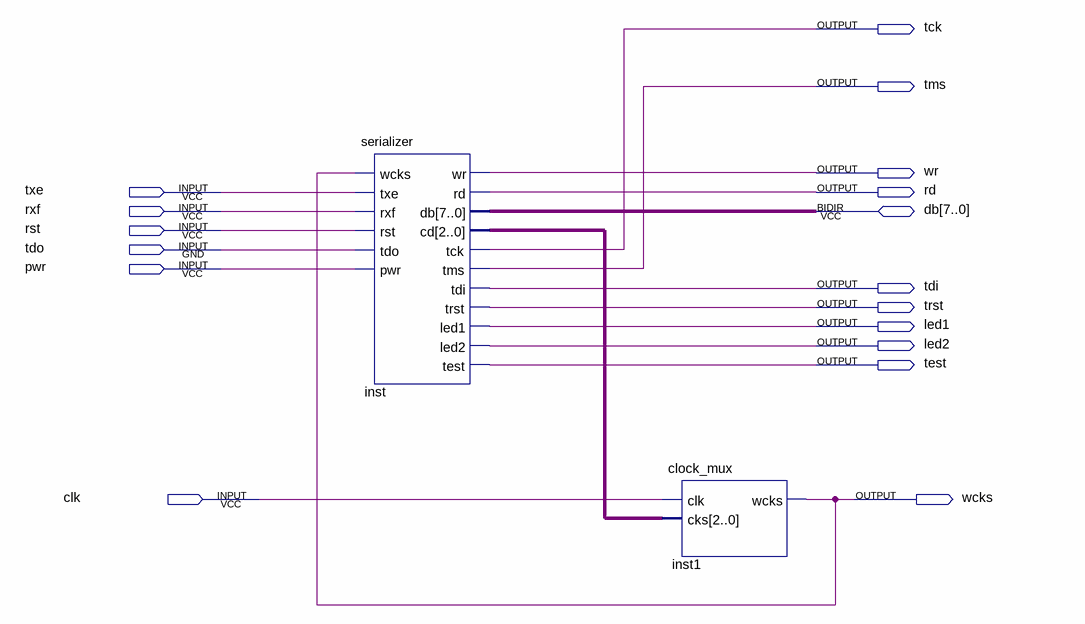
[diagram p0: schematic sheet]
// Quartus schematic Open_JTAG.bdf as structural Verilog: 2 symbols, 17 pins
module Open_JTAG (
  input  txe,
  input  rxf,
  input  rst,
  input  tdo,
  input  pwr,
  input  clk,
  inout  [7:0] db,
  output tck,
  output tms,
  output wr,
  output rd,
  output tdi,
  output trst,
  output led1,
  output led2,
  output test,
  output wcks
);

  wire [2:0] inst_cd;

  serializer inst (
    .wcks(wcks), .txe(txe), .rxf(rxf), .rst(rst), .tdo(tdo), .pwr(pwr), .wr(wr), .rd(rd), .cd(inst_cd),
    .tck(tck), .tms(tms), .tdi(tdi), .trst(trst), .led1(led1), .led2(led2), .test(test), .db(db));
  clock_mux inst1 (.clk(clk), .cks(inst_cd), .wcks(wcks));
endmodule
